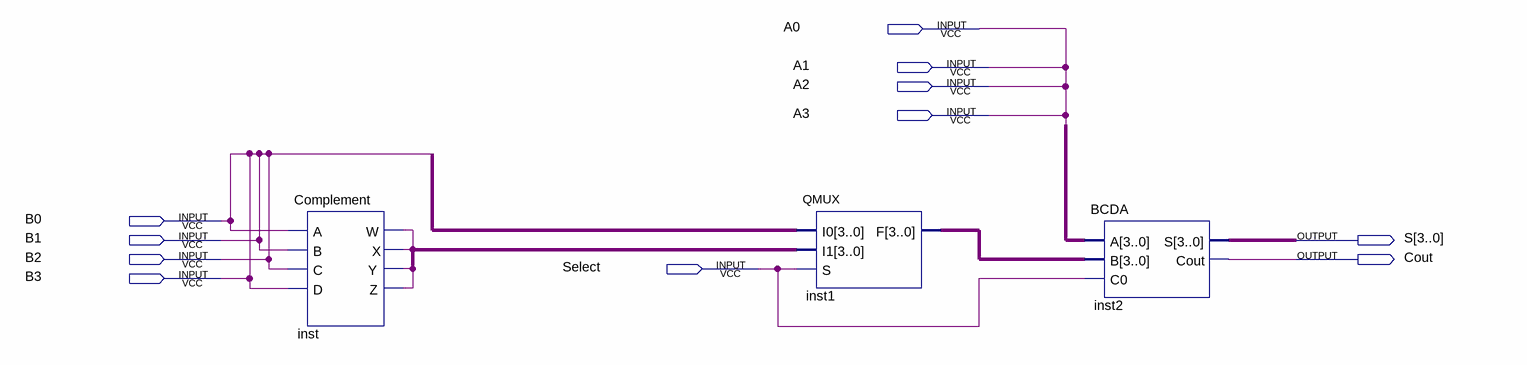
[diagram p0: schematic sheet]
// Quartus schematic Block_for_circuitss.bdf as structural Verilog: 3 symbols, 11 pins
module Block_for_circuitss (
  input  A0,
  input  A1,
  input  A2,
  input  A3,
  input  B0,
  input  B1,
  input  B2,
  input  Select,
  input  B3,
  output [3:0] S,
  output Cout
);

  wire inst_w, inst_y;
  wire [3:0] inst1_f, undriven, undriven_2, undriven_3;

  Complement inst (.A(B0), .B(B0), .C(B0), .D(B0), .W(inst_w), .X(inst_w), .Y(inst_y), .Z(inst_y));
  QMUX inst1 (.I0(undriven), .I1(undriven_2), .S(Select), .F(inst1_f));
  BCDA inst2 (.A(undriven_3), .B(inst1_f), .C0(Select), .S(S), .Cout(Cout));

  assign A1 = A0;
  assign A2 = A0;
  assign A3 = A0;
  assign B1 = B0;
  assign B2 = B0;
  assign B3 = B0;
endmodule
